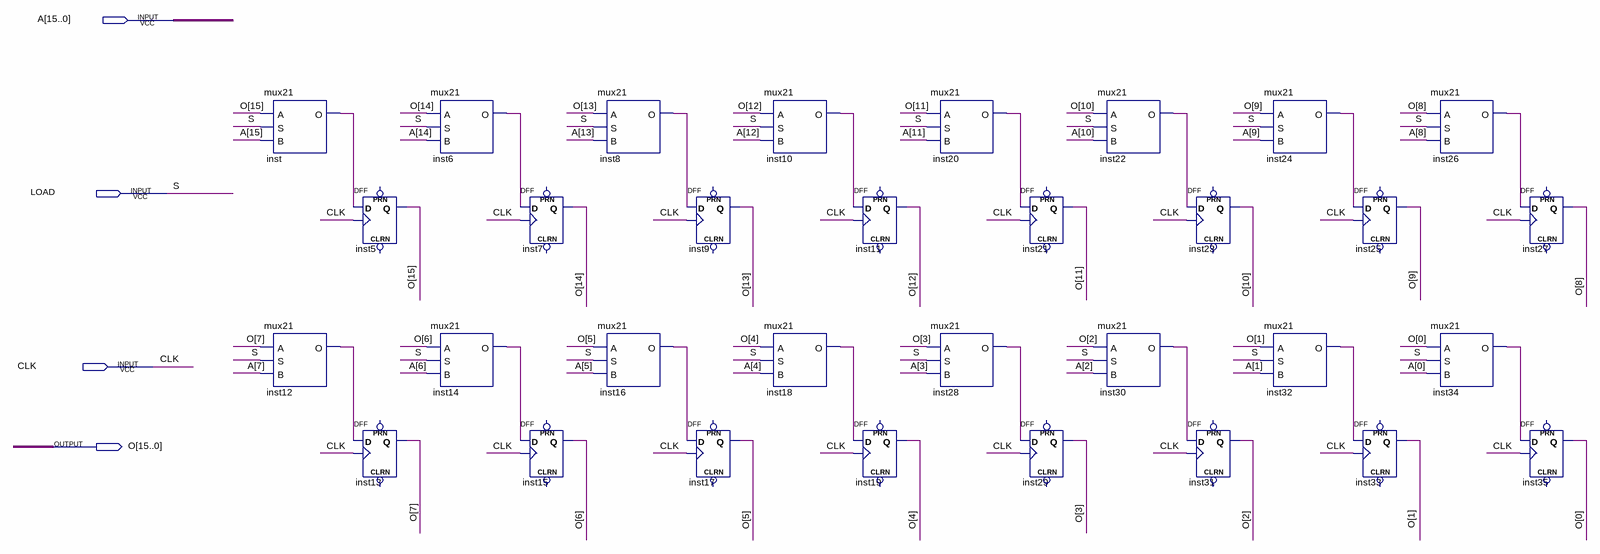
[diagram p0: schematic sheet]
// Quartus schematic SREG.bdf as structural Verilog: 32 symbols, 4 pins
module SREG (
  input  [15:0] A,
  input  LOAD,
  input  CLK,
  output [15:0] O
);

  wire inst6_o, inst8_o, inst10_o, inst12_o, inst14_o, inst16_o, inst18_o, inst20_o, inst22_o, inst24_o,
       inst26_o, inst28_o, inst30_o, inst32_o, inst34_o, inst_o;

  mux21 inst (.A(O[15]), .S(LOAD), .B(A[15]), .O(inst_o));
  mux21 inst12 (.A(O[7]), .S(LOAD), .B(A[7]), .O(inst12_o));
  DFF inst5 (.CLK(CLK), .D(inst_o), .Q(O[15]));  // open: CLRN, PRN
  DFF inst13 (.CLK(CLK), .D(inst12_o), .Q(O[7]));  // open: CLRN, PRN
  mux21 inst6 (.A(O[14]), .S(LOAD), .B(A[14]), .O(inst6_o));
  mux21 inst14 (.A(O[6]), .S(LOAD), .B(A[6]), .O(inst14_o));
  DFF inst7 (.CLK(CLK), .D(inst6_o), .Q(O[14]));  // open: CLRN, PRN
  DFF inst15 (.CLK(CLK), .D(inst14_o), .Q(O[6]));  // open: CLRN, PRN
  mux21 inst8 (.A(O[13]), .S(LOAD), .B(A[13]), .O(inst8_o));
  mux21 inst16 (.A(O[5]), .S(LOAD), .B(A[5]), .O(inst16_o));
  DFF inst9 (.CLK(CLK), .D(inst8_o), .Q(O[13]));  // open: CLRN, PRN
  DFF inst17 (.CLK(CLK), .D(inst16_o), .Q(O[5]));  // open: CLRN, PRN
  mux21 inst10 (.A(O[12]), .S(LOAD), .B(A[12]), .O(inst10_o));
  mux21 inst18 (.A(O[4]), .S(LOAD), .B(A[4]), .O(inst18_o));
  DFF inst11 (.CLK(CLK), .D(inst10_o), .Q(O[12]));  // open: CLRN, PRN
  DFF inst19 (.CLK(CLK), .D(inst18_o), .Q(O[4]));  // open: CLRN, PRN
  mux21 inst20 (.A(O[11]), .S(LOAD), .B(A[11]), .O(inst20_o));
  mux21 inst28 (.A(O[3]), .S(LOAD), .B(A[3]), .O(inst28_o));
  DFF inst21 (.CLK(CLK), .D(inst20_o), .Q(O[11]));  // open: CLRN, PRN
  DFF inst29 (.CLK(CLK), .D(inst28_o), .Q(O[3]));  // open: CLRN, PRN
  mux21 inst22 (.A(O[10]), .S(LOAD), .B(A[10]), .O(inst22_o));
  mux21 inst30 (.A(O[2]), .S(LOAD), .B(A[2]), .O(inst30_o));
  DFF inst23 (.CLK(CLK), .D(inst22_o), .Q(O[10]));  // open: CLRN, PRN
  DFF inst31 (.CLK(CLK), .D(inst30_o), .Q(O[2]));  // open: CLRN, PRN
  mux21 inst24 (.A(O[9]), .S(LOAD), .B(A[9]), .O(inst24_o));
  mux21 inst32 (.A(O[1]), .S(LOAD), .B(A[1]), .O(inst32_o));
  DFF inst25 (.CLK(CLK), .D(inst24_o), .Q(O[9]));  // open: CLRN, PRN
  DFF inst33 (.CLK(CLK), .D(inst32_o), .Q(O[1]));  // open: CLRN, PRN
  mux21 inst26 (.A(O[8]), .S(LOAD), .B(A[8]), .O(inst26_o));
  mux21 inst34 (.A(O[0]), .S(LOAD), .B(A[0]), .O(inst34_o));
  DFF inst27 (.CLK(CLK), .D(inst26_o), .Q(O[8]));  // open: CLRN, PRN
  DFF inst35 (.CLK(CLK), .D(inst34_o), .Q(O[0]));  // open: CLRN, PRN

  // Other names for the same wires on the sheet: S = LOAD
endmodule
